# EAGLE design PiLoraGatewayV2.4 (EAGLE 6.4)
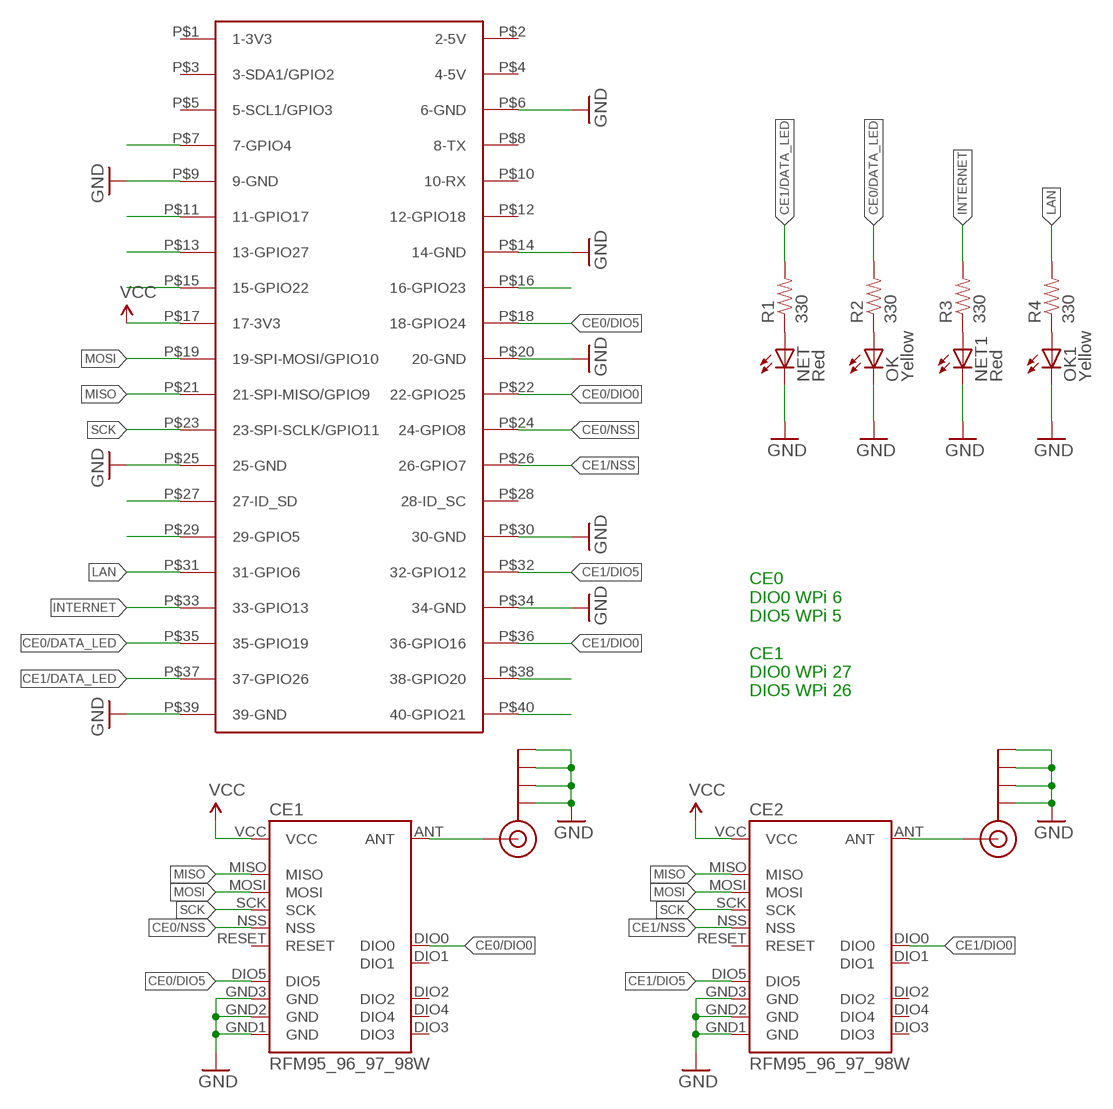
[diagram p0: schematic, sheet 1]

## Parts
CE1  RFM95_96_97_98W  [RFM95_96_97_98W]
CE2  RFM95_96_97_98W  [RFM95_96_97_98W]
J$1  SMA_EDGE  [SMA-EDGE]
J$2  SMA_EDGE  [SMA-EDGE]
NET  Red  LED0603  [LED-0603]
NET1  Red  LED0603  [LED-0603]
OK  Yellow  LED0603  [LED-0603]
OK1  Yellow  LED0603  [LED-0603]
R1  330  RESISTOR0603-RES  [0603-RES]
R2  330  RESISTOR0603-RES  [0603-RES]
R3  330  RESISTOR0603-RES  [0603-RES]
R4  330  RESISTOR0603-RES  [0603-RES]
U$1  RASPBERRY-PI+  [RASPBERRY-PI-PLUS-CAM_NOTCH]

## Nets
CE0/DATA_LED: R2.2 U$1.P$35(35-GPIO19)
CE0/DIO0: CE1.DIO0 U$1.P$22(22-GPIO25)
CE0/DIO5: CE1.DIO5 U$1.P$18(18-GPIO24)
CE0/NSS: CE1.NSS U$1.P$24(24-GPIO8)
CE1/DATA_LED: R1.2 U$1.P$37(37-GPIO26)
CE1/DIO0: CE2.DIO0 U$1.P$36(36-GPIO16)
CE1/DIO5: CE2.DIO5 U$1.P$32(32-GPIO12)
CE1/NSS: CE2.NSS U$1.P$26(26-GPIO7)
GND: CE1.GND1(GND) CE1.GND2(GND) CE1.GND3(GND) CE2.GND1(GND) CE2.GND2(GND) CE2.GND3(GND) J$1.GND@0(GND) J$1.GND@1(GND) J$1.GND@2(GND) J$1.GND@3(GND) J$2.GND@0(GND) J$2.GND@1(GND) J$2.GND@2(GND) J$2.GND@3(GND) NET1.C NET.C OK1.C OK.C U$1.P$6(6-GND) U$1.P$9(9-GND) U$1.P$14(14-GND) U$1.P$20(20-GND) U$1.P$25(25-GND) U$1.P$30(30-GND) U$1.P$34(34-GND) U$1.P$39(39-GND)
INTERNET: R3.2 U$1.P$33(33-GPIO13)
LAN: R4.2 U$1.P$31(31-GPIO6)
MISO: CE1.MISO CE2.MISO U$1.P$21(21-SPI-MISO/GPIO9)
MOSI: CE1.MOSI CE2.MOSI U$1.P$19(19-SPI-MOSI/GPIO10)
N$1: CE1.ANT J$1.SIG(SIGNAL)
N$2: CE2.ANT J$2.SIG(SIGNAL)
N$3: NET1.A R3.1
N$4: OK1.A R4.1
N$10: U$1.P$16(16-GPIO23)
N$12: OK.A R2.1
N$17: NET.A R1.1
N$24: U$1.P$38(38-GPIO20)
N$25: U$1.P$40(40-GPIO21)
N$28: U$1.P$7(7-GPIO4)
N$33: U$1.P$11(11-GPIO17)
N$34: U$1.P$13(13-GPIO27)
N$35: U$1.P$15(15-GPIO22)
N$41: U$1.P$27(27-ID_SD)
N$42: U$1.P$29(29-GPIO5)
SCK: CE1.SCK CE2.SCK U$1.P$23(23-SPI-SCLK/GPIO11)
VCC: CE1.VCC CE2.VCC U$1.P$17(17-3V3)
Unconnected: CE1.DIO1 CE1.DIO2 CE1.DIO3 CE1.DIO4 CE1.RESET CE2.DIO1 CE2.DIO2 CE2.DIO3 CE2.DIO4 CE2.RESET U$1.P$1(1-3V3) U$1.P$2(2-5V) U$1.P$3(3-SDA1/GPIO2) U$1.P$4(4-5V) U$1.P$5(5-SCL1/GPIO3) U$1.P$8(8-TX) U$1.P$10(10-RX) U$1.P$12(12-GPIO18) U$1.P$28(28-ID_SC)

## Notes on the sheet
- CE0 
  DIO0 WPi 6 
  DIO5 WPi 5
  
  CE1
  DIO0 WPi 27
  DIO5 WPi 26

## Library data of the parts
CE1 CE2 = Ava:RFM95_96_97_98W
J$1 J$2 = SparkFun:SMA_EDGE: SMA Antenna Connector End launch SMA connector. The paste layer has been removed so that the connector can be hand soldered onto the board after reflow.
NET NET1 OK OK1 = SparkFun:LED: LEDs Standard schematic elements and footprints for 5mm, 3mm, 1206, and 0603 sized LEDs. 5mm - Spark Fun Electronics SKU : COM-00529 (and others)
R1-R4 = SparkFun:RESISTOR: Resistor Basic schematic elements and footprints for 0603, 1206, and PTH resistors.
U$1 = Ava:RASPBERRY-PI+: Samtec SSW-120-01-T-D

## Net classes
0 default: width 0.203 mm
1 vcc: width 0.254 mm

## Board
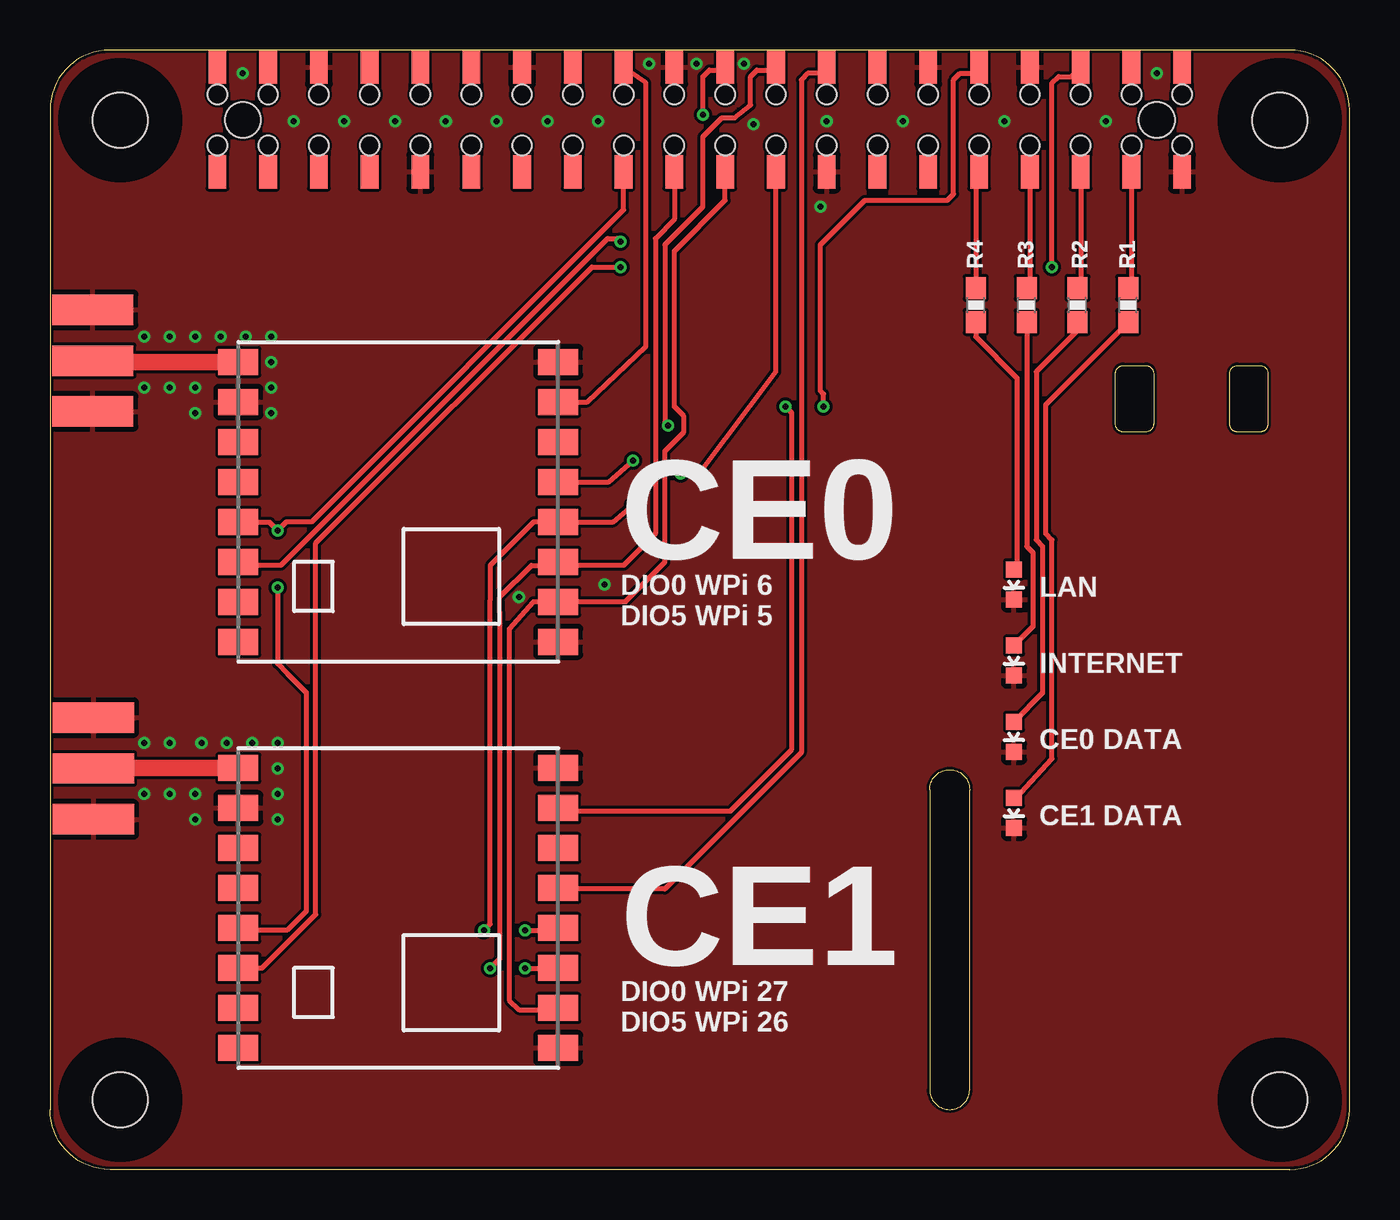
[diagram p1: board, top side]
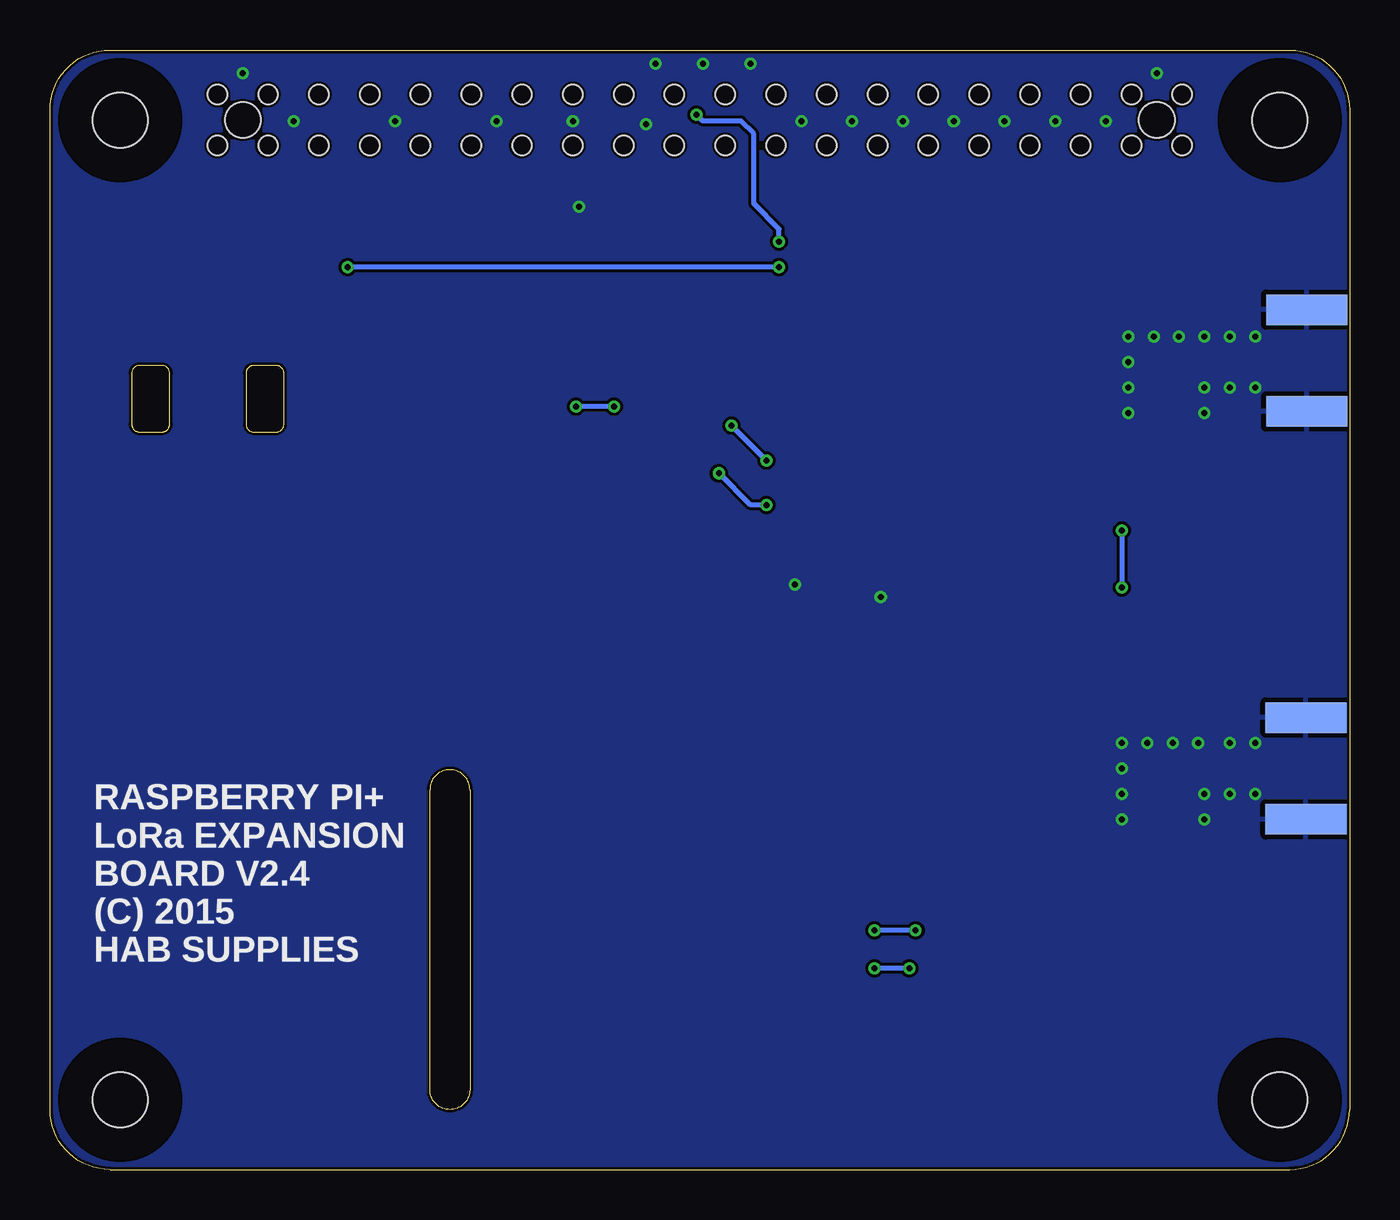
[diagram p2: board, bottom side, seen from below]

Size 65 x 56 mm. Coordinates in mm from the lower left corner, seen from the top.
Outline: 59.41,40.22 60.52,40.22 arc-90 60.91,39.82 60.91,37.29 arc-90 60.52,36.89 59.41,36.89 arc-90 59.01,37.29 59.01,39.82 arc-90 59.41,40.22
Outline: 53.7,40.22 54.8,40.22 arc-90 55.2,39.82 55.2,37.29 arc-90 54.8,36.89 53.7,36.89 arc-90 53.3,37.29 53.3,39.82 arc-90 53.7,40.22
Outline: 62,0 arc90 65,3 65,53 arc90 62,56 3,56 arc90 0,53 0,3 arc90 3,0 62,0
Outline: 44,19 44,4 arc90 45,3 arc90 46,4 46,19 arc90 45,20 arc90 44,19
Copper layers (1*16): Top 0.035mm / dielectric 1.5mm / Bottom 0.035mm
Design rules "Hackvana": minimum track width 6mil, minimum drill 0.3mm, track to track 6mil, track to pad 6mil, pad to pad 6mil, via to via 6mil, smd to smd 0mil, copper to edge 6mil, drill to drill 6mil, minimum pad ring 10mil, minimum via ring 6mil, stop-mask expansion 2mil, vias tented up to drill 100mil, thermal gap 10mil

### Footprints (pad centres in the part's own frame; a part is rotated, then mirrored left to right if it is on the bottom)
RFM95_96_97_98W = smd 2 x 1.3: ANT 8,-7; DIO0 8,3; DIO1 8,5; DIO2 8,7; DIO3 8,-3; DIO4 8,-1; DIO5 -8,-5; GND1 -8,7; GND2 8,-5; GND3 -8,-7; MISO -8,5; MOSI -8,3; NSS -8,-1; RESET -8,-3; SCK -8,1; VCC 8,1
SMA-EDGE = smd 1.524 x 4.064: GND@0 -2.54,0; GND@1 2.54,0; SIG 0,0 | smd 1.524 x 4.064 bottom: GND@2 -2.54,0; GND@3 2.54,0
LED-0603 = smd 0.8 x 0.8: A 0,-0.75; C 0,0.75
0603-RES = smd 1.1 x 1: 1 -0.85,0; 2 0.85,0
RASPBERRY-PI-PLUS-CAM_NOTCH = smd 0.889 x 1.68: P$1 -34.13,21.905; P$2 -34.13,27.145; P$3 -31.59,21.905; P$4 -31.59,27.145; P$5 -29.05,21.905; P$6 -29.05,27.145; P$7 -26.51,21.905; P$8 -26.51,27.145; P$9 -23.97,21.905; P$10 -23.97,27.145; P$11 -21.43,21.905; P$12 -21.43,27.145; P$13 -18.89,21.905; P$14 -18.89,27.145; P$15 -16.35,21.905; P$16 -16.35,27.145; P$17 -13.81,21.905; P$18 -13.81,27.145; P$19 -11.27,21.905; P$20 -11.27,27.145; P$21 -8.73,21.905; P$22 -8.73,27.145; P$23 -6.19,21.905; P$24 -6.19,27.145; P$25 -3.65,21.905; P$26 -3.65,27.145; P$27 -1.11,21.905; P$28 -1.11,27.145; P$29 1.43,21.905; P$30 1.43,27.145; P$31 3.97,21.905; P$32 3.97,27.145; P$33 6.51,21.905; P$34 6.51,27.145; P$35 9.05,21.905; P$36 9.05,27.145; P$37 11.59,21.905; P$38 11.59,27.145; P$39 14.13,21.905; P$40 14.13,27.145 | hole 2.75: -39,24.5; 19,24.5; -39,-24.5; 19,-24.5 | hole 1.78: -32.86,24.5; 12.86,24.5 | hole 0.97: -34.13,25.77; -31.59,25.77; -29.05,25.77; -26.51,25.77; -23.97,25.77; -21.43,25.77; -18.89,25.77; -16.35,25.77; -13.81,25.77; -11.27,25.77; -8.73,25.77; -6.19,25.77; -3.65,25.77; -1.11,25.77; 1.43,25.77; 3.97,25.77; 6.51,25.77; 9.05,25.77; 11.59,25.77; 14.13,25.77; -34.13,23.23; -31.59,23.23; -29.05,23.23; -26.51,23.23; -23.97,23.23; -21.43,23.23; -18.89,23.23; -16.35,23.23; -13.81,23.23; -11.27,23.23; -8.73,23.23; -6.19,23.23; -3.65,23.23; -1.11,23.23; 1.43,23.23; 3.97,23.23; 6.51,23.23; 9.05,23.23; 11.59,23.23; 14.13,23.23

### Placement (x,y rotation side)
CE1  17.42,33.4 180 top
CE2  17.42,13.08 180 top
J$1  2.14,40.46 270 top
J$2  2.18,20.06 90 top
NET  48.22,17.84 180 top
NET1  48.22,25.46 180 top
OK  48.22,21.65 180 top
OK1  48.22,29.27 180 top
R1  53.93,43.24 90 top
R2  51.39,43.24 90 top
R3  48.85,43.24 90 top
R4  46.31,43.24 90 top
U$1  42.5,28 0 top

### Tracks (layer width: path | path; a pad name or v marks a point on that pad's centre or on a via)
CE0/DATA_LED
  Top 0.254: U$1.P$35 51.55,44.25 R2.2
CE0/DIO0  (via drill 0.3)
  Top 0.254: v28.53,46.41 28.37,46.57 27.89,46.57 11.54,30.22 9.43,30.22 CE1.DIO0 | v32.66,52.77 32.66,54.67 32.98,54.99 33.61,54.99 U$1.P$22
  Bottom 0.254: v28.53,46.41 28.53,47.05 29.8,48.32 29.8,51.81 30.44,52.45 32.34,52.45 v32.66,52.77
CE0/DIO5
  Top 0.254: U$1.P$18 29.8,54.35 29.8,41.18 26.86,38.4 CE1.DIO5
CE0/NSS  (via drill 0.3)
  Top 0.254: U$1.P$24 36.15,54.99 35.36,54.99 35.04,54.67 35.04,53.24 34.24,52.61 33.61,52.61 32.66,51.65 32.66,48.16 30.75,46.26 30.75,37.37 v30.91,37.21 | CE1.NSS 27.94,34.4 v29.16,35.46
  Bottom 0.254: v29.16,35.46 v30.91,37.21
CE1/DATA_LED
  Top 0.254: U$1.P$37 54.09,44.25 R1.2
CE1/DIO0  (via drill 0.3)
  Top 0.254: CE2.DIO0 10.61,10.08 13.29,12.76 13.29,31.33 27.1,45.14 v28.53,45.14 | v50.12,45.14 50.12,54.35 50.44,54.67 51.08,54.67 U$1.P$36
  Bottom 0.254: v28.53,45.14 v50.12,45.14
CE1/DIO5  (via drill 0.3)
  Top 0.254: v36.78,38.16 37.1,37.84 37.1,21.02 34.01,17.92 25.58,17.92 CE2.DIO5 | U$1.P$32 46.15,54.83 45.52,54.83 45.2,54.51 45.2,48.8 44.88,48.48 40.75,48.48 38.53,46.26 38.53,38.95 38.69,38.8 v38.69,38.16
  Bottom 0.254: v36.78,38.16 v38.69,38.16
CE1/NSS
  Top 0.254: U$1.P$26 38.85,54.99 38.69,54.83 37.9,54.83 37.58,54.51 37.58,20.86 30.75,14.03 25.46,14.03 CE2.NSS
GND  (via drill 0.3)
  other vias: 23.45,28.64 27.74,29.27 7.26,39.11 5.99,39.11 4.72,39.11 4.72,41.65 5.99,41.65 7.26,41.65 8.53,41.65 9.8,41.65 11.07,41.65 11.07,40.38 11.07,39.11 11.07,37.84 7.26,37.84 7.26,18.79 5.99,18.79 4.72,18.79 7.26,17.52 5.99,21.33 7.58,21.33 4.72,21.33 8.84,21.33 10.12,21.33 11.39,21.33 11.39,20.06 11.39,18.79 11.39,17.52 47.74,52.45 42.66,52.45 27.42,52.45 24.88,52.45 22.34,52.45 19.8,52.45 17.26,52.45 14.72,52.45 12.18,52.45 52.82,52.45 35.2,52.29 38.53,48.16 38.85,52.45 29.96,55.3 32.34,55.3 34.72,55.3 55.36,54.83 9.64,54.83
  pour Top: -0.05,56.1 65.04,56.1 65.04,-0.26 -0.05,-0.26
  pour Bottom: -0.2,56.26 64.88,56.26 64.88,-0.1 -0.2,-0.1
INTERNET
  Top 0.254: U$1.P$33 49.01,44.25 R3.2
LAN
  Top 0.254: 46.47,44.25 R4.2 46.31,49.91 U$1.P$31
MISO
  Top 0.254: U$1.P$21 33.77,48.48 31.23,45.94 31.23,38.16 31.7,37.68 31.7,36.89 30.75,35.94 30.75,30.38 28.77,28.4 CE1.MISO 24.16,28.4 22.97,27.05 22.97,8.47 23.45,8 25.34,8 CE2.MISO
MOSI  (via drill 0.3)
  Top 0.254: v22.02,10.06 22.5,10.54 22.5,27.36 22.5,27.84 22.5,28.64 24.09,30.22 25.4,30.22 CE1.MOSI 25.43,30.22 28.69,30.22 30.28,31.81 30.28,46.57 31.23,47.53 U$1.P$19 | v23.77,10.06 25.4,10.06 CE2.MOSI
  Bottom 0.254: v22.02,10.06 v23.77,10.06
N$1
  Top 0.813: 2.36,40.24 J$1.SIG 2.2,40.4 CE1.ANT
N$2
  Top 0.813: CE2.ANT 2.19,20.08 J$2.SIG
N$3
  Top 0.254: R3.1 48.85,31.18 49.17,30.86 49.17,27.16 NET1.A
N$4
  Top 0.254: R4.1 46.31,41.65 48.37,39.59 48.37,30.18 OK1.A
N$12
  Top 0.254: R2.1 51.39,41.97 49.33,39.91 49.33,31.49 49.64,31.18 49.64,23.83 OK.A
N$17
  Top 0.254: NET.A 48.33,18.59 50.12,20.54 50.12,31.49 49.8,31.81 49.8,38.26 R1.1
SCK  (via drill 0.3)
  Top 0.254: v31.55,34.83 32.5,34.83 36.31,39.91 U$1.P$23 | v29.16,33.24 28.16,32.4 CE1.SCK 24.2,32.4 22.02,30.22 22.02,28.5 22.02,12.28 v21.7,11.97 | v23.77,11.97 25.31,11.97 CE2.SCK
  Bottom 0.254: v21.7,11.97 v23.77,11.97 | v29.16,33.24 29.96,33.24 v31.55,34.83
VCC  (via drill 0.3)
  Top 0.254: U$1.P$17 28.69,48 13.08,32.4 11.81,32.4 v11.39,31.97 10.99,32.37 9.45,32.37 CE1.VCC | CE2.VCC 9.53,11.97 11.86,11.97 12.81,12.92 12.81,13.08 12.81,18.48 12.81,21.33 12.81,21.97 12.81,23.87 11.86,24.82 11.39,25.3 v11.39,29.11
  Bottom 0.254: v11.39,31.97 v11.39,29.11

### Text on the board
tPlace: CE0 | LAN | DIO0 WPi 6 / DIO5 WPi 5 | INTERNET | CE0 DATA | CE1 DATA | CE1 | DIO0 WPi 27 / DIO5 WPi 26
bPlace: RASPBERRY PI+ / LoRa EXPANSION / BOARD V2.4 / (C) 2015 / HAB SUPPLIES
_tNames: R4 | R3 | R2 | R1